# Altium schematic sheet Sheet2.SchDoc
size A2; SheetNumber: 1; SheetTotal: 1
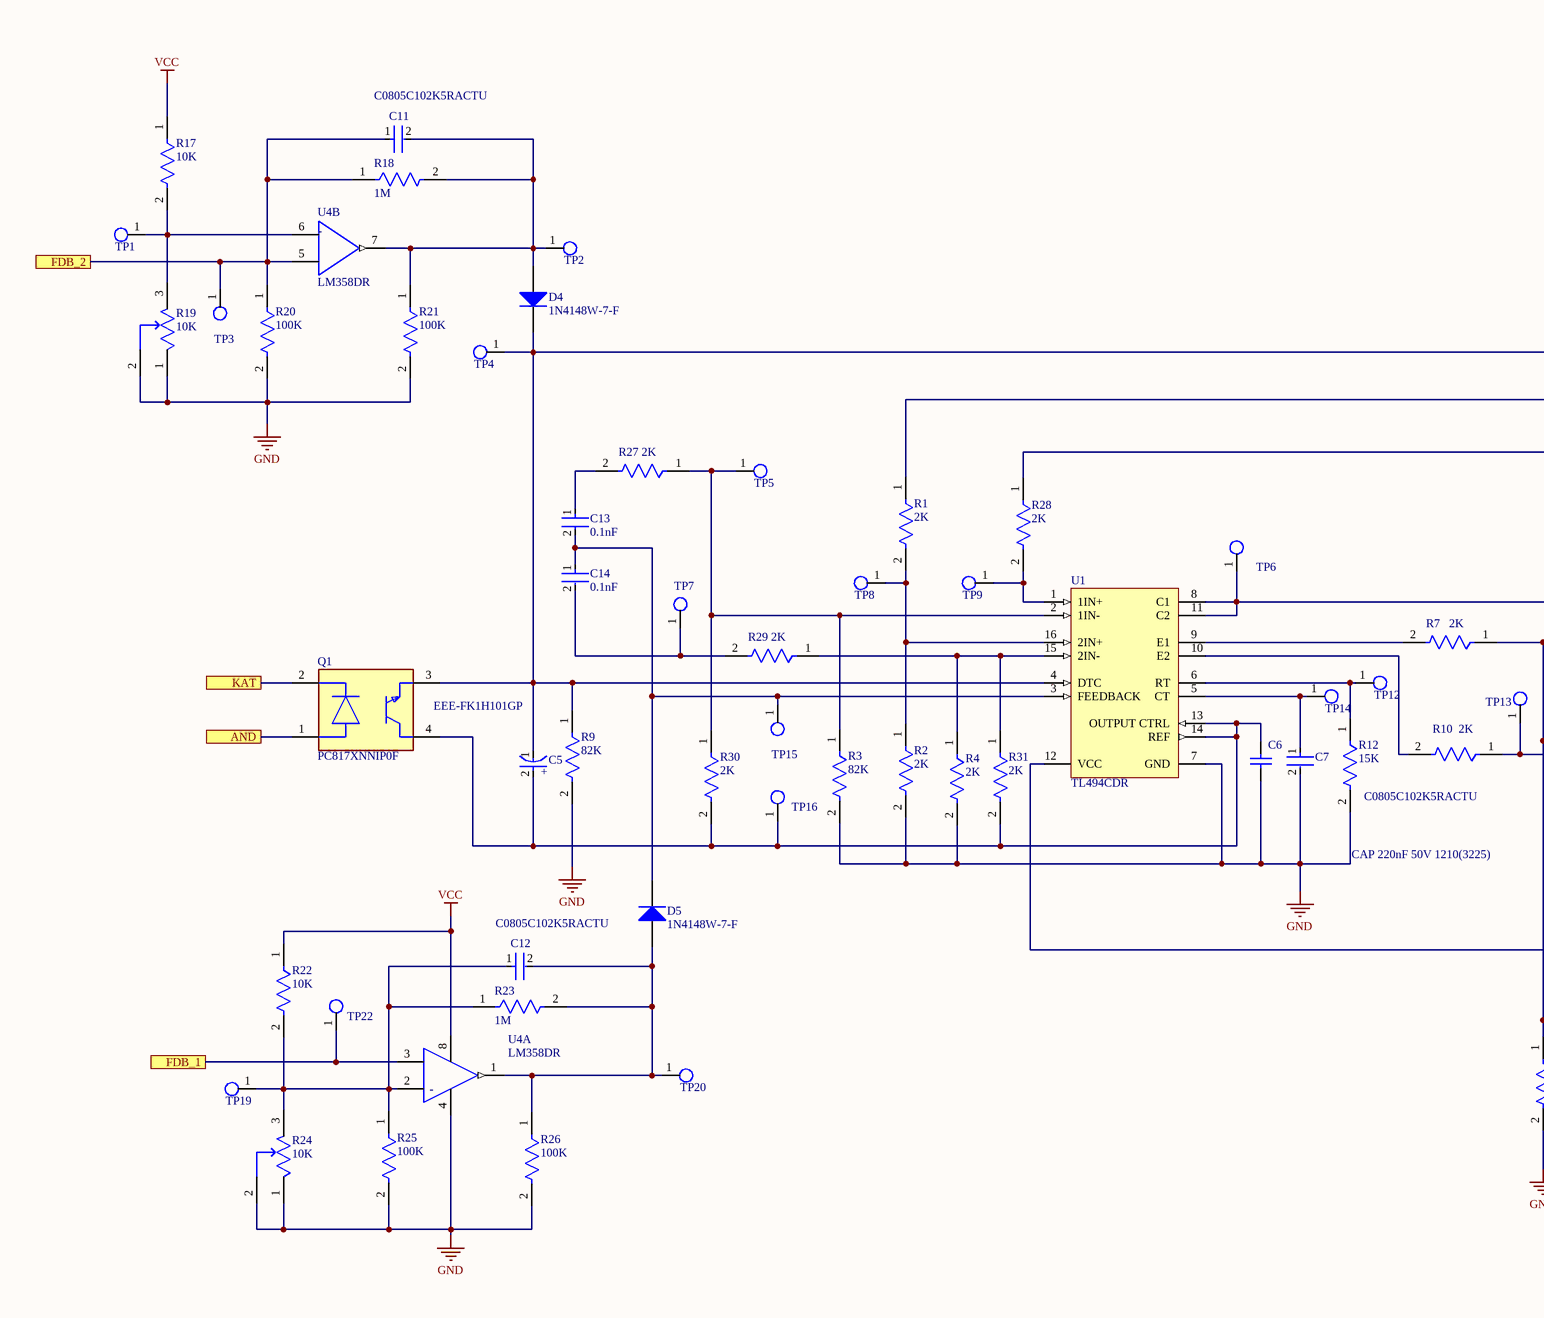
[diagram p0: Sheet2.SchDoc, left]
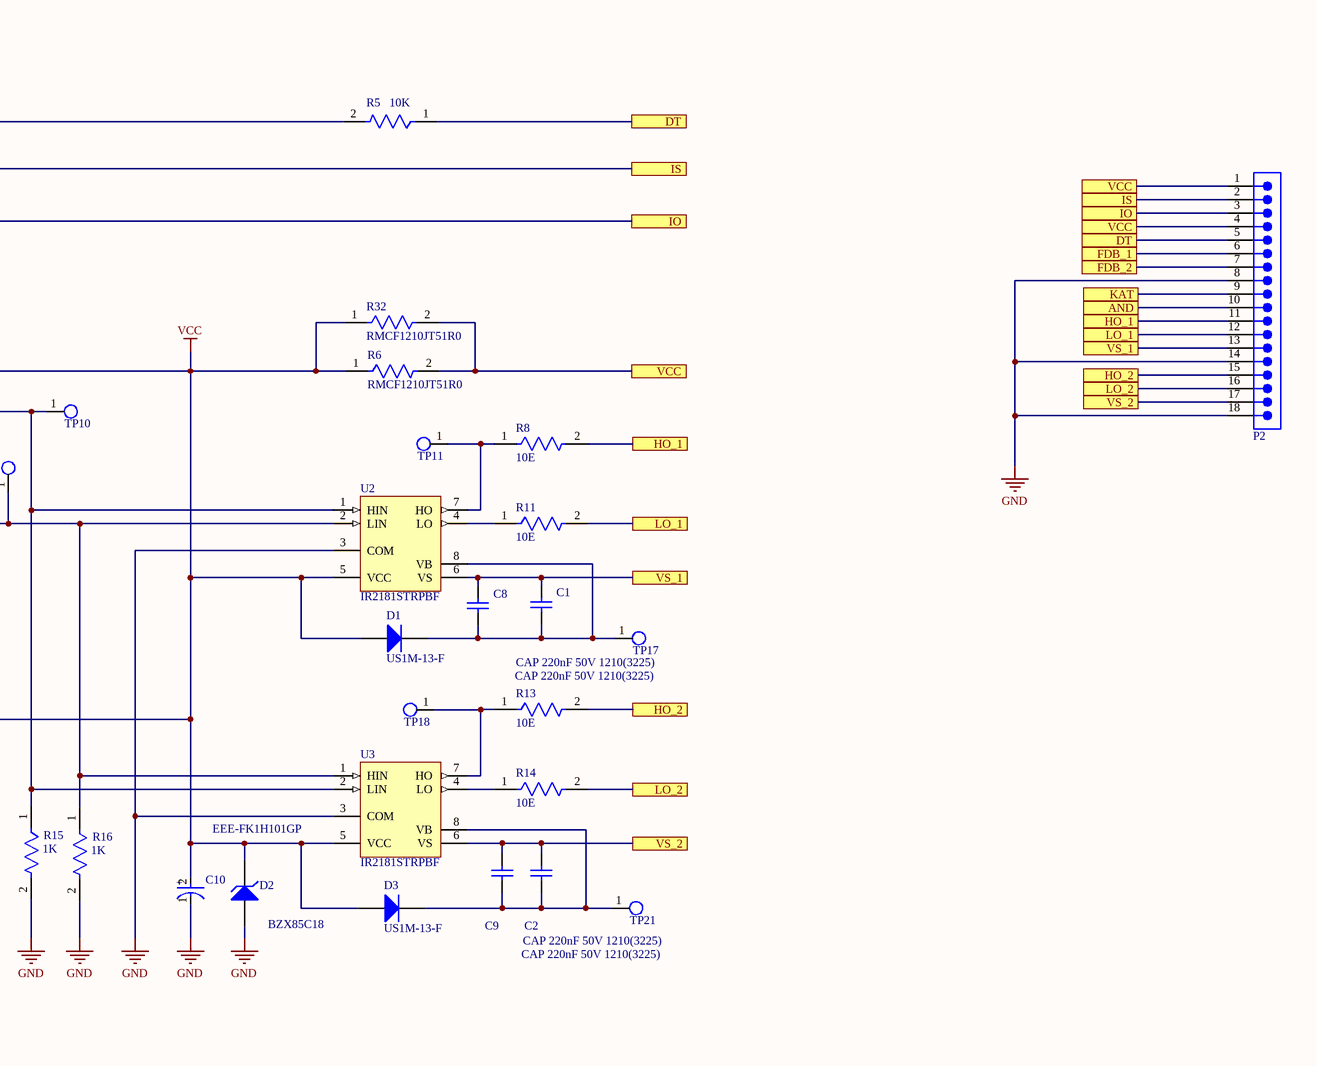
[diagram p1: Sheet2.SchDoc, right]

## Parts
C1  CAP 220nF 50V 1210(3225)  [CAPC1210(3225)100_M]
C2  CAP 220nF 50V 1210(3225)  [CAPC1210(3225)100_M]
C5  EEE-FK1H101GP  [FP-FKF-MFG]
C6  CAP 220nF 50V 1210(3225)  [CAPC1210(3225)100_M]
C7  C0805C102K5RACTU  [FP-C0805C-DN-MFG]
C8  CAP 220nF 50V 1210(3225)  [CAPC1210(3225)100_M]
C9  CAP 220nF 50V 1210(3225)  [CAPC1210(3225)100_M]
C10  EEE-FK1H101GP  [FP-FKF-MFG]
C11  C0805C102K5RACTU  [FP-C0805C-DN-MFG]
C12  C0805C102K5RACTU  [FP-C0805C-DN-MFG]
C13  0.1nF  [FP-C0805C-DN-MFG]
C14  0.1nF  [FP-C0805C-DN-MFG]
D1  US1M-13-F  [DIOD-SMA-2_A_V]
D2  BZX85C18  [FAIR-DO-41-2]
D3  US1M-13-F  [DIOD-SMA-2_A_V]
D4  1N4148W-7-F  [DIOD-SOD123-2_V]
D5  1N4148W-7-F  [DIOD-SOD123-2_V]
P2  61301811021  [61301811021]  (value not drawn)
Q1  PC817XNNIP0F  [FP-PC817XNNIP0F-MFG]
R1  2K  [FP-CRCW0805-e3-MFG]
R2  2K  [FP-CRCW0805-e3-MFG]
R3  82K  [FP-CRCW0805-e3-MFG]
R4  2K  [FP-CRCW0805-e3-MFG]
R5  10K  [FP-CRCW0805-e3-MFG]
R6  RMCF1210JT51R0  [FP-RMCF1210-MFG]
R7  2K  [FP-CRCW0805-e3-MFG]
R8  10E  [FP-CRCW1210-e3-IPC_B]
R9  82K  [FP-CRCW0805-e3-MFG]
R10  2K  [FP-CRCW0805-e3-MFG]
R11  10E  [FP-CRCW1210-e3-IPC_B]
R12  15K  [FP-CRCW0805-e3-MFG]
R13  10E  [FP-CRCW1210-e3-IPC_B]
R14  10E  [FP-CRCW1210-e3-IPC_B]
R15  1K  [FP-CRCW0805-e3-MFG]
R16  1K  [FP-CRCW0805-e3-MFG]
R17  10K  [FP-CRCW0805-e3-MFG]
R18  1M  [FP-CRCW0805-e3-MFG]
R19  10K  [FP-3296W-MFG]
R20  100K  [FP-CRCW0805-e3-MFG]
R21  100K  [FP-CRCW0805-e3-MFG]
R22  10K  [FP-CRCW0805-e3-MFG]
R23  1M  [FP-CRCW0805-e3-MFG]
R24  10K  [FP-3296W-MFG]
R25  100K  [FP-CRCW0805-e3-MFG]
R26  100K  [FP-CRCW0805-e3-MFG]
R27  2K  [FP-CRCW0805-e3-MFG]
R28  2K  [FP-CRCW0805-e3-MFG]
R29  2K  [FP-CRCW0805-e3-MFG]
R30  2K  [FP-CRCW0805-e3-MFG]
R31  2K  [FP-CRCW0805-e3-MFG]
R32  RMCF1210JT51R0  [FP-RMCF1210-MFG]
TP1  Test_Point_PCB  [Test_Point]  (value not drawn)
TP2  Test_Point_PCB  [Test_Point]  (value not drawn)
TP3  Test_Point_PCB  [Test_Point]  (value not drawn)
TP4  Test_Point_PCB  [Test_Point]  (value not drawn)
TP5  Test_Point_PCB  [Test_Point]  (value not drawn)
TP6  Test_Point_PCB  [Test_Point]  (value not drawn)
TP7  Test_Point_PCB  [Test_Point]  (value not drawn)
TP8  Test_Point_PCB  [Test_Point]  (value not drawn)
TP9  Test_Point_PCB  [Test_Point]  (value not drawn)
TP10  Test_Point_PCB  [Test_Point]  (value not drawn)
TP11  Test_Point_PCB  [Test_Point]  (value not drawn)
TP12  Test_Point_PCB  [Test_Point]  (value not drawn)
TP13  Test_Point_PCB  [Test_Point]  (value not drawn)
TP14  Test_Point_PCB  [Test_Point]  (value not drawn)
TP15  Test_Point_PCB  [Test_Point]  (value not drawn)
TP16  Test_Point_PCB  [Test_Point]  (value not drawn)
TP17  Test_Point_PCB  [Test_Point]  (value not drawn)
TP18  Test_Point_PCB  [Test_Point]  (value not drawn)
TP19  Test_Point_PCB  [Test_Point]  (value not drawn)
TP20  Test_Point_PCB  [Test_Point]  (value not drawn)
TP21  Test_Point_PCB  [Test_Point]  (value not drawn)
TP22  Test_Point_PCB  [Test_Point]  (value not drawn)
U1  TL494CDR  [D0016A_N]
U2  IR2181STRPBF  [INTR-SOIC-8_V]
U3  IR2181STRPBF  [INTR-SOIC-8_V]
U4  LM358DR  [FP-D0008A-MFG]  (parts A,B of 2)

## Ports
AND, DT, FDB_1, FDB_2, HO_1, HO_2, IO, IS, KAT, LO_1, LO_2, VCC, VS_1, VS_2

## Nets
GND: C6.1 C7.2 C10.1(C) D2.1(A) P2.8 P2.14 P2.18 R2.2 R3.2 R4.2 R9.2 R12.2 R15.2 R16.2 R19.1(CCW) R19.2(WIPER) R20.2 R21.2 R24.1(CCW) R24.2(WIPER) R25.2 R26.2 U1.7(GND) U2.3(COM) U3.3(COM) U4.4(V-)
VCC: C10.2(A) D1.1(A) D2.2(K) D3.1(A) R6.1 R17.1 R22.1 R32.1 TP6.1(G9) U1.8(C1) U1.11(C2) U1.12(VCC) U2.5(VCC) U3.5(VCC) U4.8(V+)
AND: P2.10 Q1.1(A) ; port AND
DT: P2.5 R5.1 ; port DT
FDB_1: P2.6 TP22.1(G9) U4.3(IN1+) ; port FDB_1
FDB_2: C11.1 P2.7 R18.1 R20.1 TP3.1(G9) U4.5(IN2+) ; port FDB_2
HO_1: P2.11 R8.2 ; port HO_1
HO_2: P2.15 R13.2 ; port HO_2
IO: P2.3 R28.1 ; port IO
IS: P2.2 R1.1 ; port IS
KAT: P2.9 Q1.2(C) ; port KAT
LO_1: P2.12 R11.2 ; port LO_1
LO_2: P2.16 R14.2 ; port LO_2
VCC: P2.1 P2.4 R6.2 R32.2 ; port VCC  [a separate net that carries the same name]
VS_1: C1.2 C8.2 P2.13 U2.6(VS) ; port VS_1
VS_2: C2.2 C9.2 P2.17 U3.6(VS) ; port VS_2
NetC1_1: C1.1 C8.1 D1.2(K) TP17.1(G9) U2.8(VB)
NetC2_1: C2.1 C9.1 D3.2(K) TP21.1(G9) U3.8(VB)
NetC5_1: C5.1(C) D4.2(K) Q1.3(E) R5.2 R9.1 TP4.1(G9) U1.4(DTC)
NetC5_2: C5.2(A) C6.2 Q1.4(C) R30.2 R31.2 TP16.1(G9) U1.13(OUTPUT_CTRL) U1.14(REF)
NetC7_1: C7.1 TP14.1(G9) U1.5(CT)
NetC11_2: C11.2 D4.1(A) R18.2 R21.1 TP2.1(G9) U4.7(2OUT)
NetC12_1: C12.1 R22.2 R23.1 R24.3(CW) R25.1 TP19.1(G9) U4.2(IN1-)
NetC12_2: C12.2 D5.1(A) R23.2 R26.1 TP20.1(G9) U4.1(1OUT)
NetC13_1: C13.1 R27.2
NetC13_2: C13.2 C14.1 D5.2(K) TP15.1(G9) U1.3(FEEDBACK)
NetC14_2: C14.2 R29.2 TP7.1(G9)
NetR1_2: R1.2 R2.1 TP8.1(G9) U1.16(2IN+)
NetR3_1: R3.1 R27.1 R30.1 TP5.1(G9) U1.2(1IN-)
NetR4_1: R4.1 R29.1 R31.1 U1.15(2IN-)
NetR7_1: R7.1 R15.1 TP10.1(G9) U2.1(HIN) U3.2(LIN)
NetR7_2: R7.2 U1.9(E1)
NetR8_1: R8.1 TP11.1(G9) U2.7(HO)
NetR10_1: R10.1 R16.1 TP13.1(G9) U2.2(LIN) U3.1(HIN)
NetR10_2: R10.2 U1.10(E2)
NetR11_1: R11.1 U2.4(LO)
NetR12_1: R12.1 TP12.1(G9) U1.6(RT)
NetR13_1: R13.1 TP18.1(G9) U3.7(HO)
NetR14_1: R14.1 U3.4(LO)
NetR17_2: R17.2 R19.3(CW) TP1.1(G9) U4.6(IN2-)
NetR28_2: R28.2 TP9.1(G9) U1.1(1IN+)

## Notes on the sheet
- (in symbol CMP-1685-00009-2, part A) -
- (in symbol CMP-1685-00009-2, part B) -
- (in symbol CMP-05427-000032-1) +

## Library data of the parts
C1 C2 C6 C8 C9 = CMP-1038-01811-1: CAP 220nF 50V ±10% 1210 (3225 Metric) Thickness 1mm SMD; Case-EIA: 1210; Case-Metric: 3225; Tolerance: Â±10%; Technology: SMT; Max Thickness: 1 mm; Value: 220nF; Rated Voltage: 50 V
C5 C10 = CMP-05427-000032-1: CAP ALUM 100UF 20% 50V SMD; Ripple Current (AC): 350mA; Impedance: 340mR; Life (Hours): 5000Hour; Leakage Current: 10mA; Voltage: 50V; Voltage Rating (DC): 50V; ESR (Equivalent Series Resistance): 340mR; Packaging: Tape and Reel; Radiation Hardening: No; Construction: Cylindrical; Case/Package: SMD/SMT; Contact Plating: Tin; Min Operating Temperature: -55°C; Lead Free: Lead Free; Mount: Surface Mount; Number of Pins: 2; Height: 10.2mm; Tolerance: 20%; Package Quantity: 1; Voltage Rating: 50V; Termination: SMD/SMT; Width: 10mm; Max Operating Temperature: 105°C; Height - Seated (Max): 0.402inch; RoHS Compliant: Yes; Ripple Current: 350mA; Length: 10.2mm; Capacitance: 100uF; Series: FK; REACH SVHC: No SVHC; Diameter: 8mm
C7 C11 C12 = CMP-2007-01097-2: CAP CER 1000PF 50V X7R 0805; Manufacturer: KEMET; Capacitance: 1,000 pF; Value: 1,000 pF; Tolerance: 0.1; Temperature Coefficient: 30ppm/°C; Material: Ceramic; Temperature Range High: +125°C; Automotive: No; Device Class L3: Ceramic Capacitors; Category: Cap; Height: 0.88mm; Ipc Land Pattern Name: CAPC200125X78; Mouser Description: Cap Ceramic 0.001uF 50V X7R 10% SMD 0805 125C Plastic T/R; Device Class L1: Passive Components; Lead Free: Yes; Temperature Range Low: -55°C; ComponentLink2URL: https://content.kemet.com/datasheets/KEM_C1003_C0G_SMD.pdf; Octopart: https://octopart.com/c0805c102k5ractu-kemet-93010; Temperature: -55°C to +125°C; Package: C0805C-DN; RoHS: TRUE; Voltage Rating: 50 V; ComponentLink2Description: Datasheet; Digikey Description: CAP CER 1000PF 50V X7R 0805; Device Class L2: Capacitors; Manufacturer Part Number: C0805C102K5RACTU; Temperature Characteristic: X7R
C13 C14 = CMP-2007-00254-2: CAP CER 10000PF 50V X7R 0805; Manufacturer Part Number: C0805C103J5RACTU; Manufacturer: KEMET; Value: 10,000 pF; Material: Ceramic; Temperature Coefficient: 30ppm/°C; Tolerance: 0.05; Device Class L1: Passive Components; Temperature: -55°C to +125°C; Lead Free: Yes; ComponentLink2URL: https://content.kemet.com/datasheets/KEM_C1003_C0G_SMD.pdf; Device Class L3: Ceramic Capacitors; Temperature Characteristic: X7R; Temperature Range High: +125°C; Mouser Description: Capacitor; Ceramic; Cap 0.01uF; Tol 5%; Vol-Rtg 50 V; SMT; Case 0805; X7R; TR; ComponentLink2Description: Datasheet; Height: 0.88mm; Digikey Description: CAP CER 10000PF 50V X7R 0805; Capacitance: 10,000 pF; Temperature Range Low: -55°C; Device Class L2: Capacitors; Octopart: https://octopart.com/c0805c103j5ractu-kemet-133473; Voltage Rating: 50 V; Category: Cap; RoHS: TRUE; Automotive: No; Package: C0805C-DN; Ipc Land Pattern Name: CAPC200125X78
D1 D3 = CMP-2000-07364-1: Ultra-Fast Rectifier, 1 A, 1.7 V, -65 to 150 degC, 2-Pin SMA, RoHS, Tape and Reel; Manufacturer: Diodes Inc; Forward Voltage: 1.7V; Reverse Recovery Time-Max: 75ns; Average Rectified Current-Max: 1A; Reverse Current-Max: 5µA; Reverse Voltage-Max [Vrrm]: 1000V; Package Description: 2-Pin Surface Mount Device, Body 4.3 x 2.605 mm; Datasheet URL: http://www.diodes.com/_files/datasheets/ds16008.pdf; Datasheet Version: Rev. 11-2, 12/2014; Package Reference: SMA-2; Mounting Technology: SurfaceMount; Manufacturer URL: http://www.diodes.com/
D2 = CMP-2000-05984-1: Zener Diode, 18 V, +/- 5%, -60 to 200 degC, 2-Pin DO-204AL (DO-41), RoHS, Bulk; Manufacturer: FairchildSemiconductor; Rad Hard: No; Configuration: Single; Nominal Zener Voltage: 17.95V; Package Version: Rev. 2, 09/2008; Maximum Power Dissipation: 1000mW; Maximum Reverse Leakage Current: 0.5uA; Mounting Technology: ThroughHole; Package URL: http://www.fairchildsemi.com/dwg/DO/DO41A.pdf; Datasheet Version: Rev. 1.1.0, 09/2013; Zener Voltage Tolerance: 5%; Operating Temperature: -65to200°C; Manufacturer URL: https://www.fairchildsemi.com/; Package: 2DO-41; Packaging: Bulk; Package Reference: DO-41-2; Package Description: 2-Pin Axial Lead, Dia 2.375 mm, Body Length 4.63 mm; Category: Zener; Datasheet URL: https://www.fairchildsemi.com/datasheets/BZ/BZX85C10.pdf; Mounting: ThroughHole
D4 D5 = CMP-2000-04932-2: Fast Switching Diode, 100 V, 0.15 A, -65 to 150 degC, 2-Pin?SOD123, RoHS, Tape and Reel; Recovery Time: 4ns; Brand: DiodesIncorporated; Unit Weight: 0.000353oz; Max Surge Current: 2A; Peak Reverse Voltage: 100V; Ir - Reverse Current: 1uA; Vf - Forward Voltage: 1.25V; Configuration: Single; If - Forward Current: 0.15A; Product Category: Diodes-GeneralPurpose,Power,Switching; Operating Temperature Range: -65Cto+150C; Packaging: Reel; Manufacturer URL: http://www.diodes.com/; Maximum Operating Temperature: +150C; Height: 1.25mm; Minimum Operating Temperature: -65C; Product: SwitchingDiodes; Package URL: http://www.diodes.com/datasheets/ds18004.pdf; Type: SwitchingDiode; Package Reference: SOD123-2; Width: 1.7mm; Datasheet URL: http://www.farnell.com/datasheets/1915529.pdf; Datasheet Version: Rev. 24-2, 10/2013; Series: 1N4148; Factory Pack Quantity: 3000; Length: 2.85mm; RoHS: True; Manufacturer: DiodesIncorporated; Mounting Style: SMD/SMT; Package / Case: SOD-123
P2 = 61301811021: WR-PHD Pin Header, THT, Angled, pitch 2.54mm, 1 Row, 18P; Manufacturer: Wurth Elektronik; Contact Resistance: 20mΩ; Rated Current: 3A; Working Voltage: 250V; Withstanding Voltage: 500V; ComponentLink1Description: Website Link; ComponentLink1URL: https://www.we-online.com/redexpert/article/61301811021?ad; ComponentLink2Description: Datasheet Link; ComponentLink2URL: https://www.we-online.com/redexpert/spec/61301811021?ad; Manufacturer Part Number: 61301811021; Category: Board-to-Board Connectors; Match Code: WR-PHD; Mount: Through Hole; Operating Temperature Max: 105°C; Operating Temperature Min: -40°C; Packaging: Bag; Gender: Pin Header; Number of Pins: 18; Number of Rows: 1; Orientation: Angled; Pitch: 2.54mm
Q1 = CMP-65434-000005-1: OPTOISOLATOR 5KV TRANS 4SMD; Reverse Breakdown Voltage: 6V; Output Current per Channel: 30mA; Power Dissipation: 200mW; Collector-emitter Voltage-Max: 200mV; Max Output Voltage: 80V; Input Current: 50mA; Forward Voltage: 1.4V; Fall Time: 18000ns; Number of Elements: 1; Input Type: DC; Packaging: Tape and Reel; RoHS Compliant: Yes; Contact Plating: Copper; Min Operating Temperature: -30°C; Collector Emitter Saturation Voltage: 200mV; Max Input Current: 50mA; Radiation Hardening: No; Max Collector Current: 50mA; Case/Package: SMD/SMT; Mount: Surface Mount; Output Voltage: 80V; Forward Current: 50mA; Max Power Dissipation: 200mW; Collector Emitter Voltage (VCEO): 80V; Number of Channels: 1; Rise Time: 18000ns; Isolation Voltage: 5kV; Number of Pins: 4; Lead Free: Lead Free; Package Quantity: 2000; Isolation Voltage-Max: 5kV; Max Operating Temperature: 100°C
R1 R2 R4 R7 R10 R15 R16 R27-R31 = CMP-2001-04908-2: RES Thick Film, 2kΩ, 1%, 0.125W, 100ppm/°C, 0805; Resistance: 10kR; Voltage Rating (DC): 150V; Power Rating: 125mW; Weight: 0.000194oz; Package Quantity: 5000; Military Standard: Not; Max Operating Temperature: 155°C; Temperature Coefficient: 100ppm/°C; Contact Plating: Tin; Width: 1.25mm; Height: 0.45mm; Radiation Hardening: No; Tolerance: 1%; Min Operating Temperature: -55°C; Voltage Rating: 150V; Length: 2mm; Depth: 1.25mm; Termination: SMD/SMT; Packaging: Tape and Reel; Case/Package: 0805; Case Code (Metric): 2012; Lead Free: Lead Free; Case Code (Imperial): 0805; Composition: Thick Film
R3 R9 = CMP-2001-04908-2: RES Thick Film, 82kΩ, 1%, 0.125W, 100ppm/°C, 0805; Resistance: 10kR; Voltage Rating (DC): 150V; Power Rating: 125mW; Weight: 0.000194oz; Package Quantity: 5000; Military Standard: Not; Max Operating Temperature: 155°C; Temperature Coefficient: 100ppm/°C; Contact Plating: Tin; Width: 1.25mm; Height: 0.45mm; Radiation Hardening: No; Tolerance: 1%; Min Operating Temperature: -55°C; Voltage Rating: 150V; Length: 2mm; Depth: 1.25mm; Termination: SMD/SMT; Packaging: Tape and Reel; Case/Package: 0805; Case Code (Metric): 2012; Lead Free: Lead Free; Case Code (Imperial): 0805; Composition: Thick Film
R5 R17 R22 = CMP-2001-04908-2: RES Thick Film, 10kΩ, 1%, 0.125W, 100ppm/°C, 0805; Resistance: 10kR; Voltage Rating (DC): 150V; Power Rating: 125mW; Weight: 0.000194oz; Package Quantity: 5000; Military Standard: Not; Max Operating Temperature: 155°C; Temperature Coefficient: 100ppm/°C; Contact Plating: Tin; Width: 1.25mm; Height: 0.45mm; Radiation Hardening: No; Tolerance: 1%; Min Operating Temperature: -55°C; Voltage Rating: 150V; Length: 2mm; Depth: 1.25mm; Termination: SMD/SMT; Packaging: Tape and Reel; Case/Package: 0805; Case Code (Metric): 2012; Lead Free: Lead Free; Case Code (Imperial): 0805; Composition: Thick Film
R6 R32 = CMP-26527-006785-1: 51Ω ±5% 0.5W 1210 Thick Film Chip Resistor AEC-Q200 compliant; Temperature Coefficient: 200ppm/°C; Resistance: 51R; Max Power Dissipation: 500mW; Case Code (Metric): 3225; Height: 0.028inch; Mount: Surface Mount; Max Operating Temperature: 155°C; Min Operating Temperature: -55°C; Length: 0.126inch; Features: Automotive AEC-Q200; Number of Terminations: 2; Width: 0.098inch; Case Code (Imperial): 1210; Packaging: Tape and Reel; Series: RMCF; Tolerance: 5%; Radiation Hardening: No; Contact Plating: Tin; RoHS Compliant: Yes; Case/Package: 1210; Lead Free: Lead Free; Resistor Type: Thick Film
R8 R11 R13 R14 = CMP-2005-01987-2: RES SMD 10 OHM 1% 1/2W 1992; Resistance: 0mR; Temperature Coefficient: 0ppm/°C; Max Power Dissipation: 500mW; Voltage Rating: 200V; Packaging: Tape and Reel; Max Operating Temperature: 155°C; REACH SVHC: No SVHC; Min Operating Temperature: -55°C; Package Quantity: 1; Length: 3.2mm; Case Code (Metric): 3225; Case/Package: 1210; Composition: Thick Film; Military Standard: Not; Contact Plating: Tin; Case Code (Imperial): 1210; Radiation Hardening: No; Depth: 2.5mm; Termination: SMD/SMT; Features: Automotive AEC-Q200; Width: 0.098inch; Mount: Surface Mount; Power Rating: 500mW; Weight: 0.000564oz; Number of Terminations: 2; Height: 0.55mm
R12 = CMP-2001-04908-2: RES Thick Film, 15kΩ, 1%, 0.125W, 100ppm/°C, 0805; Resistance: 10kR; Voltage Rating (DC): 150V; Power Rating: 125mW; Weight: 0.000194oz; Package Quantity: 5000; Military Standard: Not; Max Operating Temperature: 155°C; Temperature Coefficient: 100ppm/°C; Contact Plating: Tin; Width: 1.25mm; Height: 0.45mm; Radiation Hardening: No; Tolerance: 1%; Min Operating Temperature: -55°C; Voltage Rating: 150V; Length: 2mm; Depth: 1.25mm; Termination: SMD/SMT; Packaging: Tape and Reel; Case/Package: 0805; Case Code (Metric): 2012; Lead Free: Lead Free; Case Code (Imperial): 0805; Composition: Thick Film
R18 R23 = CMP-2001-04908-2: RES Thick Film, 1MΩ, 1%, 0.125W, 100ppm/°C, 0805; Resistance: 10kR; Voltage Rating (DC): 150V; Power Rating: 125mW; Weight: 0.000194oz; Package Quantity: 5000; Military Standard: Not; Max Operating Temperature: 155°C; Temperature Coefficient: 100ppm/°C; Contact Plating: Tin; Width: 1.25mm; Height: 0.45mm; Radiation Hardening: No; Tolerance: 1%; Min Operating Temperature: -55°C; Voltage Rating: 150V; Length: 2mm; Depth: 1.25mm; Termination: SMD/SMT; Packaging: Tape and Reel; Case/Package: 0805; Case Code (Metric): 2012; Lead Free: Lead Free; Case Code (Imperial): 0805; Composition: Thick Film
R19 R24 = CMP-2000-05583-2: TRIMMER 10K OHM 0.5W PC PIN TOP; Manufacturer: Bourns; Manufacturer Part Number: 3296W-1-504LF; Resistance: 500kΩ; Temperature Coefficient: 100ppm/°C; Value: 500kΩ; Tolerance: 10%; Voltage Rating: 300V; Standoff Height: 0.38mm; ComponentLink2Description: Datasheet; Package: 3296W; Series: Trimpot 3296-Sealed; Lead Free: Yes; Octopart: https://octopart.com/3296w-1-504lf-bourns-143884; Device Class L2: Resistors; Automotive: No; RoHS: TRUE; Temperature Range High: +125°C; Height: 12.05mm; Power Rating: 0.5W; Temperature Range Low: -55°C; ComponentLink2URL: https://www.bourns.com/docs/Product-Datasheets/3296.pdf; Device Class L1: Passive Components; Device Class L3: Variable Resistors and Potentiometers; Category: Res; Temperature: -55°C to +125°C; Digikey Description: TRIMMER 500K OHM 0.5W PC PIN TOP; Mouser Description: Trimmer; Cermet; Rest 500 Kilohms; PCB; 25 Turns; Pwr-Rtg 0.5W
R20 R21 R25 R26 = CMP-2001-04908-2: RES Thick Film, 100kΩ, 1%, 0.125W, 100ppm/°C, 0805; Resistance: 10kR; Voltage Rating (DC): 150V; Power Rating: 125mW; Weight: 0.000194oz; Package Quantity: 5000; Military Standard: Not; Max Operating Temperature: 155°C; Temperature Coefficient: 100ppm/°C; Contact Plating: Tin; Width: 1.25mm; Height: 0.45mm; Radiation Hardening: No; Tolerance: 1%; Min Operating Temperature: -55°C; Voltage Rating: 150V; Length: 2mm; Depth: 1.25mm; Termination: SMD/SMT; Packaging: Tape and Reel; Case/Package: 0805; Case Code (Metric): 2012; Lead Free: Lead Free; Case Code (Imperial): 0805; Composition: Thick Film
TP1-TP22 = TP_PCB?: Test_Point
U1 = CMP-0319-00950-2: Pulse-Width-Modulation Control Circuit with Voltage Control, 45 % Duty Cycle, 0 to +70 degC, 16-pin SOIC (D), Green (RoHS & no Sb/Br); Manufacturer: Texas Instruments; Regulated Outputs(#): 2; Frequency(Max)(kHz): 300; Topology: Boost, Buck, Flyback, Forward, Full-Bridge, Half-Bridge, Push-Pull; SubFamily: PWM Controller; Duty Cycle(Max)(%): 45; Rating: Military; PackageDescription: 16-Pin Plastic Small Outline Integrated Circuit, 9.9 x 3.9 mm, Pitch 1.27 mm Pitch; Mounting Technology: Surface Mount; PackageReference: D0016A; DatasheetVersion: SLVS074E; Control Method: Voltage; ComponentLink1Description: Datasheet; ComponentLink1URL: http://www.ti.com/general/docs/lit/getliterature.tsp?genericPartNumber=TL494&fileType=pdf; Code_JEDEC: MS-012AC; Eco-Plan: Green (RoHS & no Sb/Br); PackageVersion: revM, Jun-2011; PartNumber: TL494CDR
U2 U3 = CMP-1671-00001-2: IC DRIVER HIGH/LOW SIDE 8SOIC; Manufacturer: International Rectifier; PartNumber: IR2181STRPBF; ComponentLink1Description: Datasheet; ComponentLink1URL: http://www.infineon.com/dgdl/ir2181.pdf?fileId=5546d462533600a4015355c93cdd16ce; PackageReference: SOIC-8
U4 = CMP-1685-00009-2: IC OPAMP GP 2 CIRCUIT 8SOIC; Output Current: 30mA; Min Dual Supply Voltage: 1.5V; Input Offset Voltage (Vos): 7mV; Power Supply Rejection Ratio (PSRR): 65dB; Unity Gain Bandwidth Product: 700kHz; Number of Channels: 2; Min Supply Voltage: 3V; Max Dual Supply Voltage: 16V; Dual Supply Voltage: 9V; Max Supply Voltage: 32V; Nominal Supply Current: 1.2mA; Slew Rate: 0.3V/µs; Input Bias Current: 250nA; Voltage Gain: 100dB; Operating Supply Current: 1mA; REACH SVHC: No SVHC; Package Quantity: 2500; Width: 3.91mm; Max Operating Temperature: 70°C; Min Operating Temperature: 0°C; Mount: Surface Mount; Length: 4.9mm; Radiation Hardening: No; Case/Package: SOIC; Lead Free: Lead Free; Number of Elements: 2; Packaging: Tape and Reel; Output Current per Channel: 30mA; Number of Circuits: 2; Bandwidth: 700kHz; Operating Supply Voltage: 16V; Gain Bandwidth Product: 700kHz; Number of Pins: 8; Number of Amplifiers: 2; Height: 1.58mm; Common Mode Rejection Ratio: 65dB; Contact Plating: Gold